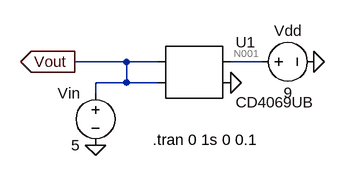
[diagram p0: schematic Q2_2.asc]
Q2_2.asc, the LTspice schematic file:
Version 4
SHEET 1 880 680
WIRE 112 80 32 80
WIRE 160 80 112 80
WIRE 320 80 272 80
WIRE 112 112 112 80
WIRE 112 112 64 112
WIRE 160 112 112 112
WIRE 64 128 64 112
FLAG 64 208 0
FLAG 32 80 Vout
IOPIN 32 80 Out
FLAG 400 80 0
FLAG 272 112 0
SYMBOL AutoGenerated\\CD4069UB 208 96 R0
SYMATTR InstName U1
SYMBOL voltage 304 80 R270
WINDOW 0 32 56 VTop 2
WINDOW 3 -32 56 VBottom 2
WINDOW 123 0 0 Left 0
WINDOW 39 0 0 Left 0
SYMATTR InstName Vdd
SYMATTR Value 9
SYMBOL voltage 64 112 M0
WINDOW 123 0 0 Left 0
WINDOW 39 0 0 Left 0
SYMATTR InstName Vin
SYMATTR Value 5
TEXT 152 200 Left 2 !.tran 0 1s 0 0.1

The netlist it stands for:
* Q2_2.asc
* U1: CD4069UB (symbol AutoGenerated\CD4069UB not available, pins judged from their places): pin1=Vout pin2=Vout pin3=N001 pin4=0
Vdd N001 0 9
Vin Vout 0 5
.tran 0 1s 0 0.1
.backanno
.end

* Results of the author's LTspice run, read from the files saved beside the schematic
* Operating Point, zero values left out:
*   V(vout) = 5 V
*   V(n001) = 9 V
*   I(Vin) = -131.1 mA
*   I(Vdd) = -484.2 µA
*   Ix(u1:Y) = 131.1 mA
*   Ix(u1:A) = 6.949 nA
*   Ix(u1:VCC) = 484.2 µA
*   Ix(u1:AGND) = -131.6 mA